# Altium project MCU103A.PrjPcb (part 3 of 4)

## Sheet MCU103A_USB_and_Power.SchDoc
size 431 x 279 mm; Date: Not shown in title block; ApprovedBy: Not shown in title block; CheckedBy: Not shown in title block; Author: Not shown in title block; CompanyName: Not shown in title block; Engineer: Not shown in title block; Organization: Not shown in title block; Address1: Not shown in title block; Address2: Not shown in title block; Address3: Not shown in title block; Address4: Not shown in title block; DocumentNumber: 6; Revision: Use project parameter SCH_Rev; SheetNumber: 6; SheetTotal: 8; PageSetup: Record=PageOptions|CenterHorizontal=True|CenterVertical=True|PrintScale=1.00|XCorrection=1.00|YCorrection=1.00|PrintKind=0|BorderSize=5000000|LeftOffset=0|BottomOffset=0|Orientation=2|PaperLength=1000|PaperWidth=1000|Scale=100|PaperSource=15|PrintQuality=600|MediaType=1|DitherType=10|PaperKind=Letter|PrintScaleMode=1; CurrentTime: Not shown in title block; CurrentDate: Not shown in title block; Time: Not shown in title block; DocumentFullPathAndName: Not shown in title block; DocumentName: Not shown in title block; ModifiedDate: Not shown in title block; ImagePath: Not shown in title block
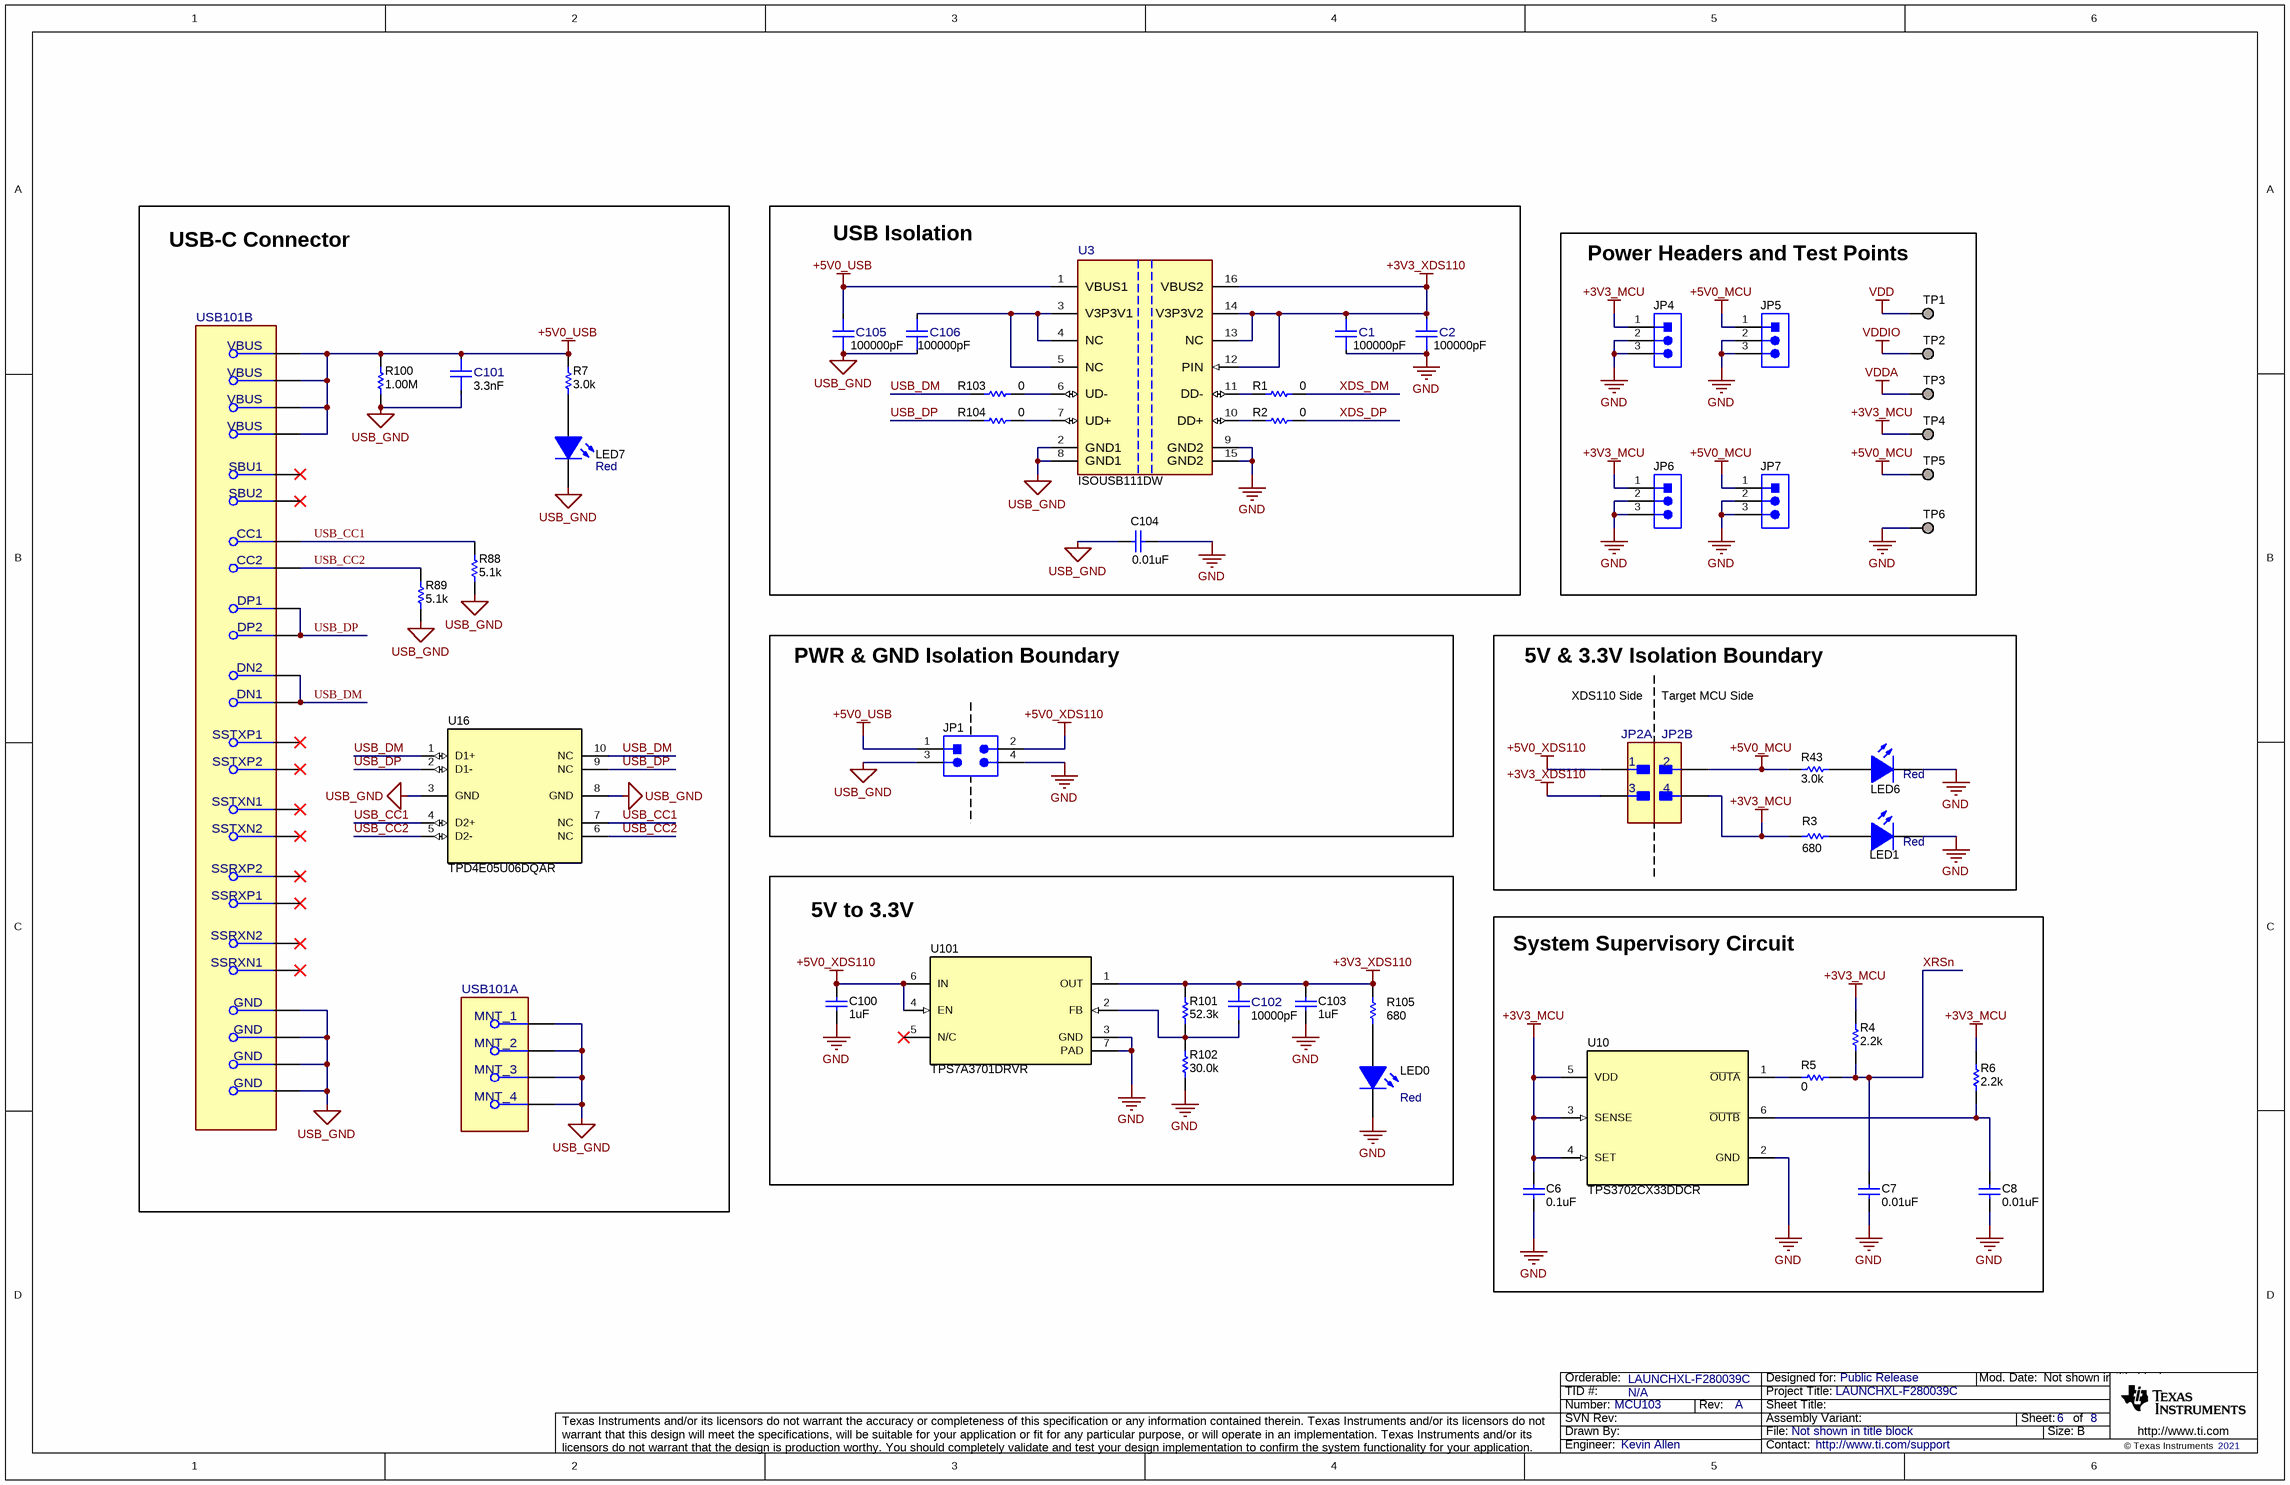
[diagram p5: MCU103A_USB_and_Power.SchDoc]

### Parts
C1  ValueDisplayed: 100000pF  [FP-885012205018_0402-MFG]  (hidden comment: 885012205018)
C2  ValueDisplayed: 100000pF  [FP-885012205018_0402-MFG]  (hidden comment: 885012205018)
C6  ValueDisplayed: 0.1uF  [0402]  (hidden comment: GRM155R71A104KA01D)
C7  ValueDisplayed: 0.01uF  [0402]  (hidden comment: GRM155R71E103KA01D)
C8  ValueDisplayed: 0.01uF  [0402]  (hidden comment: GRM155R71E103KA01D)
C100  ValueDisplayed: 1uF  [0402]  (hidden comment: 885012105012)
C101  ValueDisplayed: 3.3nF  [FP-885012205064_0402-MFG]  (hidden comment: 885012205064)
C102  ValueDisplayed: 10000pF  [FP-885012205050_0402-MFG]  (hidden comment: 885012205050)
C103  ValueDisplayed: 1uF  [0402]  (hidden comment: 885012105012)
C104  ValueDisplayed: 0.01uF  [1812]  (hidden comment: 1812SC103KAT1A)
C105  ValueDisplayed: 100000pF  [FP-885012205018_0402-MFG]  (hidden comment: 885012205018)
C106  ValueDisplayed: 100000pF  [FP-885012205018_0402-MFG]  (hidden comment: 885012205018)
JP1  TSM-102-01-L-DV  [Samtec_TSM-102-01-x-DV]  (value not drawn)
JP2  61300421121  [FP-61300421121_HDR4-MFG]  (value not drawn)  (parts A,B of 2)
JP4  61300311121  [WURTH_61300311121]  (value not drawn)
JP5  61300311121  [WURTH_61300311121]  (value not drawn)
JP6  61300311121  [WURTH_61300311121]  (value not drawn)
JP7  61300311121  [WURTH_61300311121]  (value not drawn)
LED0  value Red  [WL-SMCW_RED_0805]  (hidden comment: 150080SS75000)
LED1  value Red  [WL-SMCW_RED_0805]  (hidden comment: 150080SS75000)
LED6  value Red  [WL-SMCW_RED_0805]  (hidden comment: 150080SS75000)
LED7  value Red  [WL-SMCW_RED_0805]  (hidden comment: 150080SS75000)
R1  ValueDisplayed: 0  [0402]  (hidden comment: RC0402JR-070RL)
R2  ValueDisplayed: 0  [0402]  (hidden comment: RC0402JR-070RL)
R3  ValueDisplayed: 680  [0402]  (hidden comment: CRCW0402680RJNED)
R4  ValueDisplayed: 2.2k  [0402]  (hidden comment: CRCW04022K20JNED)
R5  ValueDisplayed: 0  [0402]  (hidden comment: CRCW04020000Z0ED)
R6  ValueDisplayed: 2.2k  [0603]  (hidden comment: CRCW06032K20JNEA)
R7  ValueDisplayed: 3.0k  [0603]  (hidden comment: RC0603JR-073KL)
R43  ValueDisplayed: 3.0k  [0603]  (hidden comment: RC0603JR-073KL)
R88  ValueDisplayed: 5.1k  [0603]  (hidden comment: RC0603JR-075K1L)
R89  ValueDisplayed: 5.1k  [0603]  (hidden comment: RC0603JR-075K1L)
R100  ValueDisplayed: 1.00M  [0402]  (hidden comment: CRCW04021M00FKED)
R101  ValueDisplayed: 52.3k  [0402]  (hidden comment: CRCW040252K3FKED)
R102  ValueDisplayed: 30.0k  [0402]  (hidden comment: CRCW040230K0FKED)
R103  ValueDisplayed: 0  [0402]  (hidden comment: RC0402JR-070RL)
R104  ValueDisplayed: 0  [0402]  (hidden comment: RC0402JR-070RL)
R105  ValueDisplayed: 680  [0402]  (hidden comment: CRCW0402680RJNED)
TP1  TESTPOINT  [TP_50MIL-25MILHOLE]  (value not drawn)  (no BOM)
TP2  TESTPOINT  [TP_50MIL-25MILHOLE]  (value not drawn)  (no BOM)
TP3  TESTPOINT  [TP_50MIL-25MILHOLE]  (value not drawn)  (no BOM)
TP4  TESTPOINT  [TP_50MIL-25MILHOLE]  (value not drawn)  (no BOM)
TP5  TESTPOINT  [TP_50MIL-25MILHOLE]  (value not drawn)  (no BOM)
TP6  TESTPOINT  [TP_50MIL-25MILHOLE]  (value not drawn)  (no BOM)
U3  ISOUSB111DW  [DW0016B-MFG]
U10  TPS3702CX33DDCR  [DDC0006A_N]
U16  TPD4E05U06DQAR  [DQA0010A]
U101  TPS7A3701DRVR  [DRV0006A]
USB101  MUP-U22001  [FP-MUP-U22001_CONN_USB_8MM94_8MM0-MFG]  (value not drawn)  (parts A,B of 2)

### Blocks framed on the sheet
USB-C Connector: C101 LED7 R7 R88 R89 R100 U16 USB101
USB Isolation: C1 C2 C104-C106 R1 R2 R103 R104 U3
Power Headers and Test Points: JP4-JP7 TP1-TP6
PWR & GND Isolation Boundary: JP1
5V & 3.3V Isolation Boundary: JP2 LED1 LED6 R3 R43
5V to 3.3V: C100 C102 C103 LED0 R101 R102 R105 U101
System Supervisory Circuit: C6-C8 R4-R6 U10

### Nets
+3V3_MCU: C6.2 JP2.4 JP4.1 JP6.1 R3.2 R4.2 R6.2 TP4.1 U10.3(SENSE) U10.4(SET) U10.5(VDD)
+3V3_XDS110: C1.2 C2.2 C102.2 C103.1 JP2.3 R101.2 R105.2 U3.12(PIN) U3.13(NC) U3.14(V3P3V2) U3.16(VBUS2) U101.1(OUT)
+5V0_MCU: JP2.2 JP5.1 JP7.1 R43.2 TP5.1
+5V0_USB: C101.2 C105.2 JP1.1 R7.2 R100.2 U3.1(VBUS1) USB101.A4(VBUS) USB101.A9(VBUS) USB101.B4(VBUS) USB101.B9(VBUS)
+5V0_XDS110: C100.1 JP1.2 JP2.1 U101.4(EN) U101.6(IN)
GND: C1.1 C2.1 C6.1 C7.2 C8.2 C100.2 C103.2 C104.1 JP1.4 JP4.2 JP4.3 JP5.2 JP5.3 JP6.2 JP6.3 JP7.2 JP7.3 LED0.1(K) LED1.1(K) LED6.1(K) R102.1 TP6.1 U3.9(GND2) U3.15(GND2) U10.2(GND) U101.3(GND) U101.7(PAD)
USB_GND: C101.1 C104.2 C105.1 C106.1 JP1.3 LED7.1(K) R88.1 R89.1 R100.1 U3.2(GND1) U3.8(GND1) U16.3(GND) U16.8(GND) USB101.1(MNT_1) USB101.2(MNT_2) USB101.3(MNT_3) USB101.4(MNT_4) USB101.A1(GND) USB101.A12(GND) USB101.B1(GND) USB101.B12(GND)
VDD: TP1.1
VDDA: TP3.1
VDDIO: TP2.1
USB_CC1: R88.2 U16.4(D2+) U16.7(NC) USB101.A5(CC1)
USB_CC2: R89.2 U16.5(D2-) U16.6(NC) USB101.B5(CC2)
USB_DM: R103.1 U16.1(D1+) U16.10(NC) USB101.A7(DN1) USB101.B7(DN2)
USB_DP: R104.1 U16.2(D1-) U16.9(NC) USB101.A6(DP1) USB101.B6(DP2)
XDS_DM: R1.2
XDS_DP: R2.2
XRSn: C7.1 R4.1 R5.2
NetC8_1: C8.1 R6.1 U10.6(~{OUTB})
NetC102_1: C102.1 R101.1 R102.2 U101.2(FB)
NetC106_2: C106.2 U3.3(V3P3V1) U3.4(NC) U3.5(NC)
NetLED0_2: LED0.2(A) R105.1
NetLED1_2: LED1.2(A) R3.1
NetLED6_2: LED6.2(A) R43.1
NetLED7_2: LED7.2(A) R7.1
NetR1_1: R1.1 U3.11(DD-)
NetR2_1: R2.1 U3.10(DD+)
NetR5_1: R5.1 U10.1(~{OUTA})
NetR103_2: R103.2 U3.6(UD-)
NetR104_2: R104.2 U3.7(UD+)

Not connected (* = marked no-connect by the designer): U101 5(N/C)*; USB101 A2(SSTXP1)* A3(SSTXN1)* A8(SBU1)* A10(SSRXN2)* A11(SSRXP2)* B2(SSTXP2)* B3(SSTXN2)* B8(SBU2)* B10(SSRXN1)* B11(SSRXP1)*

### Notes on the sheet
- XDS110 Side
- Target MCU Side
- Drawn By:
- SVN Rev:
- Number:
- TID #:
- Orderable:
- Rev:
- Sheet Title:
- File:
- Project Title:
- Designed for:
- Assembly Variant:
- Mod. Date:
- Sheet:
- Size:
- of
- B
- http://www.ti.com
- Texas Instruments and/or its licensors do not warrant the accuracy or completeness of this specification or any information contained therein. Texas Instruments and/or its licensors do not warrant that this design will meet the specifications, will be suitable for your application or fit for any particular purpose, or will operate in an implementation. Texas Instruments and/or its licensors do not warrant that the design is production worthy. You should completely validate and test your design implementation to confirm the system functionality for your application.
- Engineer:
- Contact:
- © Texas Instruments

### Library data of the parts
C1 C2 C105 C106 = CMP-0090362-1: 0.1µF ±10% 10V Ceramic Capacitor X7R 0402 (1005 Metric); Manufacturer: Wurth Electronics; AEC Qualified: No; Value: 100nF; SizeZ_mm: 0.55mm; TempCo: 15%; RoHS: TRUE; Tolerance_%: 10%; datasheet: https://www.we-online.com/catalog/datasheet/885012205018.pdf; Lead Free: Yes; Operating Temperature Range: -55°C to +125°C; ComponentLink1Description: Datasheet; Digikey Description: CAP CER 0.1UF 10V X7R 0402; Supplier Part Number 1: 732-7513-1-ND; Supplier 2: Mouser; Mouser Part Number: 710-885012205018; Digikey Part Number: 732-7513-1-ND; Temperature Characteristic: X7R; Supplier 1: Digikey; Datasheet Path: datasheets/Cap-885012205018.pdf; ComponentLink1URL: https://www.we-online.com/catalog/datasheet/885012205018.pdf; VDC_V: 10V; Supplier Part Number 2: 710-885012205018; Cap_F: 100nF; PackageReference: 0402; PartNumber: 885012205018; Part Number: 885012205018; helpURL: https://upverter.com/upn/revision/1acbe355db19639d/
C6 = CMP-0006629-2: CAP, CERM, 0.1 uF, 10 V, +/- 10%, X7R, 0402; Manufacturer: MuRata; Polarized: N; Value: 0.1uF; U/M: EA; Cap_F: 100nF; Value1: Unknown; VDC_V: 10V; TaMin_C: -55°C; TaMax_C: 125°C; SizeArea_mm2: 0.5; SizeAreaWB_mm2: 3; SizeX_mm: 1; SizeZ_mm: 0.6; AEC Category: Q200; CompType: Capacitor; PartNumber: GRM155R71A104KA01D; PackageReference: 0402; RoHS: Y; Tolerance_%: 10%; Value2: 10V; MountType: SMT; Technology: Ceramic; TempCo: X7R; Cap_Case: 0402; SizeY_mm: 0.5; Published: 2008-06-19; Publisher: Texas Instruments; LatestRevisionDate: 2017-03-09; ComponentLink1Description: Datasheet link; ComponentLink1URL: http://search.murata.co.jp/Ceramy/PnsearchViewAction.do?HnOFG=ON&HnNFG=ON&SEL_CNT=50&sLang=en&sKey=GRM155R71A104KA01D&x=9&y=9&search=startwith; Supplier 1: Digi-Key; Supplier Part Number 1: GRM155R71A104KA01D-ND; Supplier 2: Newark; Supplier Part Number 2: 14T3278; Supplier 3: Mouser; Supplier Part Number 3: 81-GRM155R71A104KA1D; AEC Qualified: ?
C7 C8 = CMP-0006658-2: CAP, CERM, 0.01 uF, 25 V, +/- 10%, X7R, 0402; Manufacturer: MuRata; Polarized: N; Value: 0.01uF; U/M: EA; Cap_F: 10nF; Value1: Unknown; VDC_V: 25V; TaMin_C: -55°C; TaMax_C: 125°C; SizeArea_mm2: 0.5; SizeAreaWB_mm2: 3; SizeX_mm: 1; SizeZ_mm: 0.6; AEC Category: Q200; CompType: Capacitor; PartNumber: GRM155R71E103KA01D; PackageReference: 0402; RoHS: Y; Tolerance_%: 10%; Value2: 25V; MountType: SMT; Technology: Ceramic; TempCo: X7R; Cap_Case: 0402; SizeY_mm: 0.5; Published: 2008-06-19; Publisher: Texas Instruments; LatestRevisionDate: 2017-03-09; ComponentLink1Description: Datasheet link; ComponentLink1URL: http://search.murata.co.jp/Ceramy/PnsearchViewAction.do?HnOFG=ON&HnNFG=ON&SEL_CNT=50&sLang=en&sKey=GRM155R71E103KA01D&x=9&y=9&search=startwith; Supplier 1: Digi-Key; Supplier Part Number 1: 490-1312-1-ND; Supplier 2: Mouser; Supplier Part Number 2: 81-GRM36X103K25; Supplier 3: Farnell; Supplier Part Number 3: 8819734; AEC Qualified: ?
C100 C103 = CMP-0064924-2: CAP, CERM, 1 uF, 10 V,+/- 20%, X5R, 0402; Manufacturer: Wurth Elektronik; Polarized: N; Value: 1uF; U/M: EA; Cap_F: 1µF; Value1: Unknown; VDC_V: 10V; TaMin_C: -55°C; TaMax_C: 85°C; SizeArea_mm2: 0.5; SizeAreaWB_mm2: 3; SizeX_mm: 1; SizeZ_mm: 0.6; AEC Category: Q200; CompType: Capacitor; PartNumber: 885012105012; PackageReference: 0402; RoHS: Y; Tolerance_%: 20%; Value2: 10V; MountType: SMT; Technology: Ceramic; TempCo: X5R; Cap_Case: 0402; SizeY_mm: 0.5; Published: 2008-06-19; Publisher: Texas Instruments; LatestRevisionDate: 2017-06-05; ComponentLink1Description: Datasheet link; ComponentLink1URL: http://katalog.we-online.de/pbs/datasheet/885012105012.pdf; Supplier 1: Digi-Key; Supplier Part Number 1: 732-7489-1-ND; Supplier 2: Newark; Supplier Part Number 2: 75Y5997; Supplier 3: Mouser; Supplier Part Number 3: 710-885012105012; AEC Qualified: N; AEC Grade: N/A
C101 = CMP-0092424-1: Cap Cer 3300pF 50V X7R 0402; Manufacturer: Wurth Electronics; TempCo: 15%; AEC Qualified: No; Value: 3.3nF; SizeZ_mm: 0.55mm; Tolerance_%: 10%; Part Number: 885012205064; Supplier 2: Mouser; RoHS: TRUE; Lead Free: Yes; ComponentLink1Description: Datasheet; Cap_F: 3.3nF; Supplier 1: Digikey; Digikey Description: CAP CER 3300PF 50V X7R 0402; Digikey Part Number: 732-7559-1-ND; Temperature Characteristic: X7R; Operating Temperature Range: -55°C to +125°C; Supplier Part Number 2: 710-885012205064; Datasheet Path: datasheets/Cap-885012205064.pdf; datasheet: https://www.we-online.com/catalog/datasheet/885012205064.pdf; helpURL: https://upverter.com/upn/revision/78c7421d1fb19545/; Supplier Part Number 1: 732-7559-1-ND; Mouser Part Number: 710-885012205064; PackageReference: 0402; PartNumber: 885012205064; ComponentLink1URL: https://www.we-online.com/catalog/datasheet/885012205064.pdf; VDC_V: 50V
C102 = CMP-0090363-1: 10000pF ±10% 25V Ceramic Capacitor X7R 0402 (1005 Metric); Manufacturer: Wurth Electronics; SizeZ_mm: 0.55mm; Cap_F: 10nF; AEC Qualified: No; Value: 10nF; TempCo: 15%; Digikey Description: CAP CER 10000PF 25V X7R 0402; RoHS: TRUE; PackageReference: 0402; Lead Free: Yes; datasheet: https://www.we-online.com/catalog/datasheet/885012205050.pdf; Datasheet Path: datasheets/Cap-885012205050.pdf; Mouser Part Number: 710-885012205050; Operating Temperature Range: -55°C to +125°C; Supplier 1: Digikey; Part Number: 885012205050; ComponentLink1URL: https://www.we-online.com/catalog/datasheet/885012205050.pdf; Tolerance_%: 10%; Digikey Part Number: 732-7545-1-ND; Temperature Characteristic: X7R; Supplier Part Number 1: 732-7545-1-ND; helpURL: https://upverter.com/upn/revision/f9df62cb48b9b255/; PartNumber: 885012205050; Supplier 2: Mouser; ComponentLink1Description: Datasheet; Supplier Part Number 2: 710-885012205050; VDC_V: 25V
C104 = CMP-0009297-2: CAP, CERM, 0.01 uF, 1500 V, +/- 10%, X7R, 1812; Manufacturer: AVX; TaMin_C: -55°C; ESR_ohm: 0.05; Polarized: N; SizeAreaWB_mm2: 23.1; Value1: 0.05 ohm; U/M: EA; Value: 0.01uF; TaMax_C: 125°C; SizeZ_mm: 1.35; SizeX_mm: 4.5; SizeY_mm: 3.2; Value2: 1500V; SizeArea_mm2: 14.4; Cap_F: 10nF; VDC_V: 1.5kV; AEC Category: Q200; Supplier Part Number 2: 96M1562; Publisher: Texas Instruments; Supplier 2: Newark; Supplier Part Number 3: 581-1812SC103KAT1A; TempCo: X7R; Supplier 3: Mouser; Published: 2008-06-19; RoHS: Y; MountType: SMT; Supplier 1: Digi-Key; PackageReference: 1812; Tolerance_%: 10%; Cap_Case: 1812; CompType: Capacitor; LatestRevisionDate: 2017-03-09; PartNumber: 1812SC103KAT1A; AEC Qualified: N; ComponentLink1Description: Datasheet link; AEC Grade: N/A; Supplier Part Number 1: 478-4735-1-ND; Technology: Ceramic; ComponentLink1URL: http://datasheets.avx.com/AVX-HV_MLCC.pdf
JP1 = CMP-0055559-1: Header, 2.54mm, 2x2, Gold, SMT; Manufacturer: Samtec; CNHeader: TRUE; Shrouded: N; Gender: Male; Cert_CSA: Y; Voltage_V: 475V; Row_Count: 2; Pitch_mm: 2.54; CT: FALSE; ComponentLink1URL: http://suddendocs.samtec.com/catalog_english/tsm.pdf; ClassName: Header; Supplier Part Number 2: 27C2242; Publisher: Texas Instruments; Supplier 2: Newark; Supplier Part Number 3: 1803290; Color: Black; Supplier 3: Farnell; RoHS: Y; MountType: SMT; Supplier 1: Digi-Key; PackageReference: Header, 2.54mm, 2x2, SMT; PinCount: 4; CompType: Header; LatestRevisionDate: 26/05/2017; PartNumber: TSM-102-01-L-DV; Orientation: Vertical; ComponentLink1Description: Datasheet URL; Supplier Part Number 1: TSM-102-01-L-DV-ND; ContactFinish: Gold; Cert_UL: Y
JP2 = CMP-0092422-1: THT Vertical Pin Header WR-PHD, Pitch 2.54 mm, Dual Row, 4 pins; Manufacturer: Wurth Electronics; DUT-Pitch_mm: 2.54mm; SizeZ_mm: 8.89mm; Voltage_V: 250V; Conn Gender: Male; AEC Qualified: No; Row_Count: 2; ContactFinish: Gold; Conn Orientation: Straight; Current_A: 3A; Supplier Part Number 2: 710-61300421121; Supplier 1: Digikey; Mouser Part Number: 710-61300421121; Operating Temperature Range: -40°C to +105°C; ComponentLink1URL: https://www.we-online.com/catalog/datasheet/61300421121.pdf; Lead Free: Yes; PinCount: 4; Supplier Part Number 1: 732-5294-ND; Part Number: 61300421121; RoHS: TRUE; Digikey Part Number: 732-5294-ND; Is Female: no; Digikey Description: CONN HEADER VERT 4POS 2.54MM; datasheet: https://www.we-online.com/catalog/datasheet/61300421121.pdf; PartNumber: 61300421121; Supplier 2: Mouser; Datasheet Path: datasheets/Conn-61300421121.pdf; PackageReference: HDR4; helpURL: https://upverter.com/upn/revision/de171c811246619e/; ComponentLink1Description: Datasheet
JP4-JP7 = CMP-0054796-1: Header, 2.54 mm, 3x1, Gold, TH; Manufacturer: Wurth Elektronik; Green_Lifecycle: Active; Green_REACh: Passed; CNHeader: TRUE; CT: FALSE; PartNumber: 61300311121; PackageReference: Header, 2.54mm, 3x1, TH; ClassName: Header; CompType: Header; RoHS: Y; MountType: TH; ComponentLink1Description: Datasheet URL; ComponentLink1URL: http://katalog.we-online.de/em/datasheet/6130xx11121.pdf; Publisher: Texas Instruments; LatestRevisionDate: 26/05/2017; Supplier 1: Digi-Key; Supplier Part Number 1: 732-5316-ND; Supplier 2: Newark; Supplier Part Number 2: 20X0950; Supplier 3: Farnell; Supplier Part Number 3: 356154; Green_EU RoHS: Passed; Green_EU RoHS-2: Incomplete
LED0 LED1 LED6 LED7 = CMP-0002951-3: LED, Red, SMD; Manufacturer: Wurth Elektronik; Type: AlInGaP; Vf_V: 1.9V; Io_A: 30mA; Vr_V: 5V; Ir_A: 25µA; Tjmax_C: 85°C; Power_TotalModule: 72mW; Value1: 0.072W; Angle: 140; CompType: LED; PartNumber: 150080SS75000; MountType: SMT; RoHS: Y; PackageReference: LED_0805; Value2: 1.9V; Color: Red; ComponentLink1URL: http://katalog.we-online.de/led/datasheet/150080SS75000.pdf; ComponentLink1Description: Datasheet link
R1 R2 R103 R104 = CMP-0027004-2: RES, 0, 5%, 0.063 W, 0402; Manufacturer: Yageo America; Power_W: 63mW; TempCo: 200 ppm/C; Value_Code: 0000; U/M: EA; Value: 0; EIA_Code: E24; SizeX_mm: 1; SizeY_mm: 0.5; SizeZ_mm: 0.6; Value2: 0.063W; VDC_V: 50V; AEC Category: Q200; Supplier Part Number 2: 603-RC0402JR-070RL; Publisher: Texas Instruments; Supplier 2: Mouser; Supplier Part Number 3: 9232516; Supplier 3: Farnell; Published: 2008-06-26; RoHS: Y; Value1: 5%; MountType: SMT; Supplier 1: Digi-Key; PackageReference: 0402; Tolerance_%: 5%; Res_ohm: 0; SizeArea_mm2: 0.5; CompType: Resistor; LatestRevisionDate: 2017-03-09; PartNumber: RC0402JR-070RL; AEC Qualified: ?; ComponentLink1Description: Datasheet link; Supplier Part Number 1: 311-0.0JRCT-ND; Technology: Thick Film; ComponentLink1URL: http://www.yageo.com/pdf/Pu-RC0402_51_PbFree_L_2.pdf
R3 R105 = CMP-0026962-3: RES, 680, 5%, 0.063 W, AEC-Q200 Grade 0, 0402; Manufacturer: Vishay-Dale; Power_W: 63mW; TempCo: 200 ppm/C; Value_Code: 680R; Value: 680; EIA_Code: E24; SizeX_mm: 1; SizeY_mm: 0.5; SizeZ_mm: 0.6; Value2: 0.063W; AEC Qualified: Y; VDC_V: 50V; AEC Category: Q200; AEC Grade: 0; Supplier Part Number 2: 59M6744; Supplier 2: Newark; Supplier Part Number 3: 71-CRCW0402J-680-E3; Supplier 3: Mouser; RoHS: E; Value1: 5%; MountType: SMT; Supplier 1: Digi-Key; PackageReference: 0402; Tolerance_%: 5%; Res_ohm: 680; SizeArea_mm2: 0.5; CompType: Resistor; PartNumber: CRCW0402680RJNED; ComponentLink1Description: Datasheet link; Supplier Part Number 1: 541-680JCT-ND; Technology: Thick Film; ComponentLink1URL: http://www.vishay.com/docs/20035/dcrcwe3.pdf
R4 = CMP-0026890-5: RES, 2.2 k, 5%, 0.063 W, AEC-Q200 Grade 0, 0402; Manufacturer: Vishay-Dale; Value: 2.2k; Value_Code: 2k20; Power_W: 63mW; Value2: 0.063W; VDC_V: 50V; TempCo: 200 ppm/C; SizeArea_mm2: 0.5; SizeX_mm: 1; SizeZ_mm: 0.6; EIA_Code: E24; AEC Category: Q200; AEC Qualified: Y; AEC Grade: 0; CompType: Resistor; PartNumber: CRCW04022K20JNED; PackageReference: 0402; RoHS: E; Res_ohm: 2.2k; Tolerance_%: 5%; Value1: 5%; MountType: SMT; Technology: Thick Film; SizeY_mm: 0.5; ComponentLink1Description: Datasheet link; ComponentLink1URL: http://www.vishay.com/docs/20035/dcrcwe3.pdf; Supplier 1: Digi-Key; Supplier Part Number 1: 541-2.2KJCT-ND; Supplier 2: Newark; Supplier Part Number 2: 59M6710; Supplier 3: Mouser; Supplier Part Number 3: 71-CRCW0402J-2.2K-E3
R5 = CMP-0026822-3: RES, 0, 5%, 0.063 W, AEC-Q200 Grade 0, 0402; Manufacturer: Vishay-Dale; Value: 0; Value_Code: 0000; Power_W: 63mW; Value2: 0.063W; VDC_V: 50V; TempCo: 200 ppm/C; SizeArea_mm2: 0.5; SizeX_mm: 1; SizeZ_mm: 0.6; EIA_Code: E24; AEC Category: Q200; AEC Qualified: Y; CompType: Resistor; PartNumber: CRCW04020000Z0ED; PackageReference: 0402; RoHS: E; Res_ohm: 0; Tolerance_%: 5%; Value1: 5%; MountType: SMT; Technology: Thick Film; SizeY_mm: 0.5; ComponentLink1Description: Datasheet link; ComponentLink1URL: http://www.vishay.com/docs/20035/dcrcwe3.pdf; Supplier 1: Digi-Key; Supplier Part Number 1: 541-0.0JCT-ND; Supplier 2: Newark; Supplier Part Number 2: 52K6543; Supplier 3: Mouser; Supplier Part Number 3: 71-CRCW0402-0-E3; AEC Grade: 0
R6 = CMP-0025769-4: RES, 2.2 k, 5%, 0.1 W, AEC-Q200 Grade 0, 0603; Manufacturer: Vishay-Dale; Value: 2.2k; Value_Code: 2k20; Power_W: 100mW; Value2: 0.1W; VDC_V: 75V; TempCo: 200 ppm/C; SizeArea_mm2: 1.28; SizeX_mm: 1.6; SizeY_mm: 0.8; SizeZ_mm: 1; EIA_Code: E24; AEC Category: Q200; AEC Qualified: Y; AEC Grade: 0; CompType: Resistor; PartNumber: CRCW06032K20JNEA; PackageReference: 0603; RoHS: E; Res_ohm: 2.2k; Tolerance_%: 5%; Value1: 5%; MountType: SMT; Technology: Thick Film; ComponentLink1Description: Datasheet link; ComponentLink1URL: http://www.vishay.com/docs/20035/dcrcwe3.pdf; Supplier 1: Digi-Key; Supplier Part Number 1: 541-2.2KGCT-ND; Supplier 2: Newark; Supplier Part Number 2: 59M6776; Supplier 3: Farnell; Supplier Part Number 3: 1652868
R7 R43 = CMP-0025921-5: RES, 3.0 k, 5%, 0.1 W, 0603; Manufacturer: Yageo; Power_W: 100mW; TempCo: 100 ppm/C; Value_Code: 3k00; Value: 3.0k; EIA_Code: E24; Res_ohm: 3k; SizeX_mm: 1.6; SizeY_mm: 0.8; SizeZ_mm: 1; Value2: 0.1W; SizeArea_mm2: 1.28; AEC Qualified: N; VDC_V: 75V; AEC Category: Q200; SizeAreaWB_mm2: 4.68; Supplier Part Number 2: 603-RC0603JR-073KL; Supplier 2: Mouser; Supplier Part Number 3: 1799415; Supplier 3: Farnell; RoHS: Y; Value1: 5%; MountType: SMT; Supplier 1: Digi-Key; PackageReference: 0603; Tolerance_%: 5%; CompType: Resistor; PartNumber: RC0603JR-073KL; ComponentLink1Description: Datasheet link; Supplier Part Number 1: 311-3.0KGRCT-ND; Technology: Thick Film; ComponentLink1URL: http://www.yageo.com/pdf/Pu-RC0603_51_PbFree_L_2.pdf; AEC Grade: N/A
R88 R89 = CMP-0025932-5: RES, 5.1 k, 5%, 0.1 W, 0603; Manufacturer: Yageo; Power_W: 100mW; TempCo: 100 ppm/C; Value_Code: 5k10; Value: 5.1k; EIA_Code: E24; SizeX_mm: 1.6; SizeY_mm: 0.8; SizeZ_mm: 1; Value2: 0.1W; SizeArea_mm2: 1.28; AEC Qualified: N; VDC_V: 75V; AEC Category: Q200; SizeAreaWB_mm2: 4.68; Supplier Part Number 2: 603-RC0603JR-075K1L; Supplier 2: Mouser; Supplier Part Number 3: 1799436; Supplier 3: Farnell; RoHS: Y; Value1: 5%; MountType: SMT; Supplier 1: Digi-Key; PackageReference: 0603; Tolerance_%: 5%; Res_ohm: 5.1k; CompType: Resistor; PartNumber: RC0603JR-075K1L; ComponentLink1Description: Datasheet link; Supplier Part Number 1: 311-5.1KGRCT-ND; Technology: Thick Film; ComponentLink1URL: http://www.yageo.com/pdf/Pu-RC0603_51_PbFree_L_2.pdf; AEC Grade: N/A
R100 = CMP-0026100-2: RES, 1.00 M, 1%, 0.063 W, AEC-Q200 Grade 0, 0402; Manufacturer: Vishay-Dale; Value: 1.00Meg; Res_ohm: 1M; Value_Code: 1M00; Power_W: 63mW; Value2: 0.063W; VDC_V: 50V; TempCo: 100 ppm/C; SizeArea_mm2: 0.5; SizeX_mm: 1; SizeZ_mm: 0.6; EIA_Code: E96; AEC Category: Q200; AEC Qualified: Y; AEC Grade: 0; CompType: Resistor; PartNumber: CRCW04021M00FKED; PackageReference: 0402; RoHS: E; Tolerance_%: 1%; Value1: 1%; MountType: SMT; Technology: Thick Film; SizeY_mm: 0.5; ComponentLink1Description: Datasheet link; ComponentLink1URL: http://www.vishay.com/docs/20035/dcrcwe3.pdf; Supplier 1: Digi-Key; Supplier Part Number 1: 541-1.00MLCT-ND; Supplier 2: Newark; Supplier Part Number 2: 52K6593; Supplier 3: Mouser; Supplier Part Number 3: 71-CRCW0402-1.0M-E3
R101 = CMP-0026441-2: RES, 52.3 k, 1%, 0.063 W, AEC-Q200 Grade 0, 0402; Manufacturer: Vishay-Dale; Power_W: 63mW; TempCo: 100 ppm/C; Value_Code: 52k3; Value: 52.3k; EIA_Code: E96; SizeX_mm: 1; SizeY_mm: 0.5; SizeZ_mm: 0.6; Value2: 0.063W; AEC Qualified: Y; VDC_V: 50V; AEC Category: Q200; AEC Grade: 0; ComponentLink1URL: http://www.vishay.com/docs/20035/dcrcwe3.pdf; Supplier Part Number 2: 52K7137; Supplier 2: Newark; Supplier Part Number 3: 71-CRCW0402-52.3K-E3; Supplier 3: Mouser; RoHS: E; Value1: 1%; MountType: SMT; Supplier 1: Digi-Key; PackageReference: 0402; Tolerance_%: 1%; Res_ohm: 52.3k; SizeArea_mm2: 0.5; CompType: Resistor; PartNumber: CRCW040252K3FKED; ComponentLink1Description: Datasheet link; Supplier Part Number 1: 541-52.3KLCT-ND; Technology: Thick Film
R102 = CMP-0078244-2: RES, 30.0 k, 1%, 0.063 W, AEC-Q200 Grade 0, 0402; Manufacturer: Vishay-Dale; Power_W: 63mW; Green_Lifecycle: Active; TempCo: 100 ppm/C; Value_Code: 30k0; Green_REACh: Passed; Value: 30.0k; Res_ohm: 30k; SizeX_mm: 1; SizeY_mm: 0.5; SizeZ_mm: 0.6; Value2: 0.063W; AEC Qualified: Y; VDC_V: 50V; AEC Grade: 0; AEC Category: Q200; ComponentLink1URL: http://www.vishay.com/docs/20035/dcrcwe3.pdf; Supplier Part Number 2: 52K6953; Supplier 2: Newark; Supplier Part Number 3: 71-CRCW0402-30K-E3; Supplier 3: Mouser; RoHS: E; Value1: 1%; MountType: SMT; Green_EU RoHS-2: Passed; Supplier 1: Digi-Key; Green_EU RoHS: Passed with Exemption; PackageReference: 0402; Tolerance_%: 1%; SizeArea_mm2: 0.5; CompType: Resistor; PartNumber: CRCW040230K0FKED; ComponentLink1Description: Datasheet link; Supplier Part Number 1: 541-30.0KLCT-ND; Technology: Thick Film
TP1-TP6 = CMP-0078143-3: TEST POINT.  No entry in BOM.; CompType: Testpoint; PackageReference: N/A; Manufacturer: N/A; PartNumber: N/A; Library Reference: TESTPOINT
U3 = CMP-0091303-1: Full/Low Speed Isolated USB Repeater, SOIC16-Wide; Manufacturer: Texas Instruments; Number Of Ports: 1; Usb Standard: USB 2.0; Min Supply Voltage: 3V; Data Rate: 12Mbits/s; Max Supply Voltage: 5.5V; TaMin_C: -40°C; SizeZ_mm: 2.65mm; TaMax_C: +125°C; Nominal Supply Current: 9-9.5mA; TJmax_C: +150°C; Standoff Height: 0.1mm; AEC Qualified: No; Part Number: ISOUSB111DW; Operating Temperature Range: -55°C to +150°C; PackageReference: SOICW16; Datasheet Path: datasheets/IC-ISOUSB111DW.pdf; Interface: USB; helpURL: https://upverter.com/upn/revision/bd93d5af0e7edffb/; RoHS: UNKNOWN; PartNumber: ISOUSB111DW
U10 = CMP-0067340-2: High-Accuracy, Fixed-Threshold OV/UV Monitor, DDC0006A (SOT-23-T-6); Alternate PartNumber: TPS3702CX33DDCT; Manufacturer: Texas Instruments; SizeArea_mm2: 4.8675; SizeAreaWB_mm2: 10.4675; SizeX_mm: 1.65; SizeY_mm: 2.95; SizeZ_mm: 0.87; CompType: IC; U/M: EA; PartNumber: TPS3702CX33DDCR; PackageReference: DDC0006A; PackageDescription: SOT-23-T-6; MountType: SMT; ComponentLink1Description: Datasheet Link; ComponentLink1URL: http://www.ti.com/lit/ds/symlink/tps3702.pdf; RoHS: Y; Publisher: Texas Instruments; LatestRevisionDate: 2017-06-09; Alternate Manufacturer: Texas Instruments
U16 = CMP-0073613-3: 4-Channel Ultra-Low-Capacitance IEC ESD Protection Diode, DQA0010A (USON-10); Alternate Manufacturer: Texas Instruments; Green_Lifecycle: Active; SizeAreaWB_mm2: 7.0; Green_REACh: Passed; SizeZ_mm: 0.55; SizeX_mm: 1.0; SizeY_mm: 2.5; CompType: IC; AEC Category: Q200; AEC Qualified: N; ComponentLink1URL: http://www.ti.com/lit/ds/symlink/tpd4e05u06.pdf; PackageDescription: USON-10; RoHS: Y; MountType: SMT; Green_EU RoHS-2: Passed; Manufacturer: Texas Instruments; Green_EU RoHS: Passed; PackageReference: DQA0010A; SizeArea_mm2: 2.5; PartNumber: TPD4E05U06DQAR; ComponentLink1Description: Datasheet Link; ComponentLink2Description: Product Folder; ComponentLink2URL: http://www.ti.com/product/tpd4e05u06; ComponentLink3Description: Online Datasheet; ComponentLink3URL: http://www.ti.com/product/tpd4e05u06/datasheet
U101 = CMP-0066914-5: 1% High-Accuracy, 1-A, Low-Dropout Regulator with Reverse Current Protection, DRV0006A (WSON-6); Manufacturer: Texas Instruments; Alternate PartNumber: TPS7A3701DRVT; SizeX_mm: 2; CompType: IC; SizeZ_mm: 0.8; SizeArea_mm2: 4; SizeAreaWB_mm2: 9; U/M: EA; PackageDescription: WSON-6; PartNumber: TPS7A3701DRVR; ComponentLink1URL: http://www.ti.com/lit/ds/symlink/tps7a3701.pdf; ComponentLink1Description: Datasheet Link; LatestRevisionDate: 2017-06-09; SizeY_mm: 2; Publisher: Texas Instruments; RoHS: Y; PackageReference: DRV0006A; MountType: SMT; Alternate Manufacturer: Texas Instruments
USB101 = CMP-0092137-1: Connector, USB Type-C 24 pin Mid Mount dual row Receptacle Surface Mount; Manufacturer: MUP; ContactFinish: Gold,Nickel; Usb Standard: OTHER; AEC Qualified: No; Conn Orientation: Horizontal; Shrouded: true; SizeZ_mm: 2.81mm; Is Female: yes; DUT-Pitch_mm: 0.5mm; Datasheet Path: datasheets/Conn-MUP-U22001.pdf; ComponentLink1URL: http://www.mupconnector.com/product/show/id/525.html; ComponentLink1Description: Datasheet; PartNumber: MUP-U22001; PackageReference: CONN_USB_8MM94_8MM0; helpURL: https://upverter.com/upn/revision/6b0c75e83cbd5706/; Part Number: MUP-U22001; RoHS: TRUE; datasheet: http://www.mupconnector.com/product/show/id/525.html; Lead Free: Yes; Operating Temperature Range: -25°C to +85°C; PinCount: 24

## Sheet MCU103A_XDS110_MCU.SchDoc
size 431 x 279 mm; Date: Not shown in title block; ApprovedBy: Not shown in title block; CheckedBy: Not shown in title block; Author: Not shown in title block; CompanyName: Not shown in title block; Engineer: Not shown in title block; Organization: Not shown in title block; Address1: Not shown in title block; Address2: Not shown in title block; Address3: Not shown in title block; Address4: Not shown in title block; DocumentNumber: 7; Revision: Use project parameter SCH_Rev; SheetNumber: 7; SheetTotal: 8; PageSetup: Record=PageOptions|CenterHorizontal=True|CenterVertical=True|PrintScale=1.00|XCorrection=1.00|YCorrection=1.00|PrintKind=0|BorderSize=5000000|LeftOffset=0|BottomOffset=0|Orientation=2|PaperLength=1000|PaperWidth=1000|Scale=100|PaperSource=15|PrintQuality=600|MediaType=1|DitherType=10|PaperKind=Letter|PrintScaleMode=1; CurrentTime: Not shown in title block; CurrentDate: Not shown in title block; Time: Not shown in title block; DocumentFullPathAndName: Not shown in title block; DocumentName: Not shown in title block; ModifiedDate: Not shown in title block; ImagePath: Not shown in title block
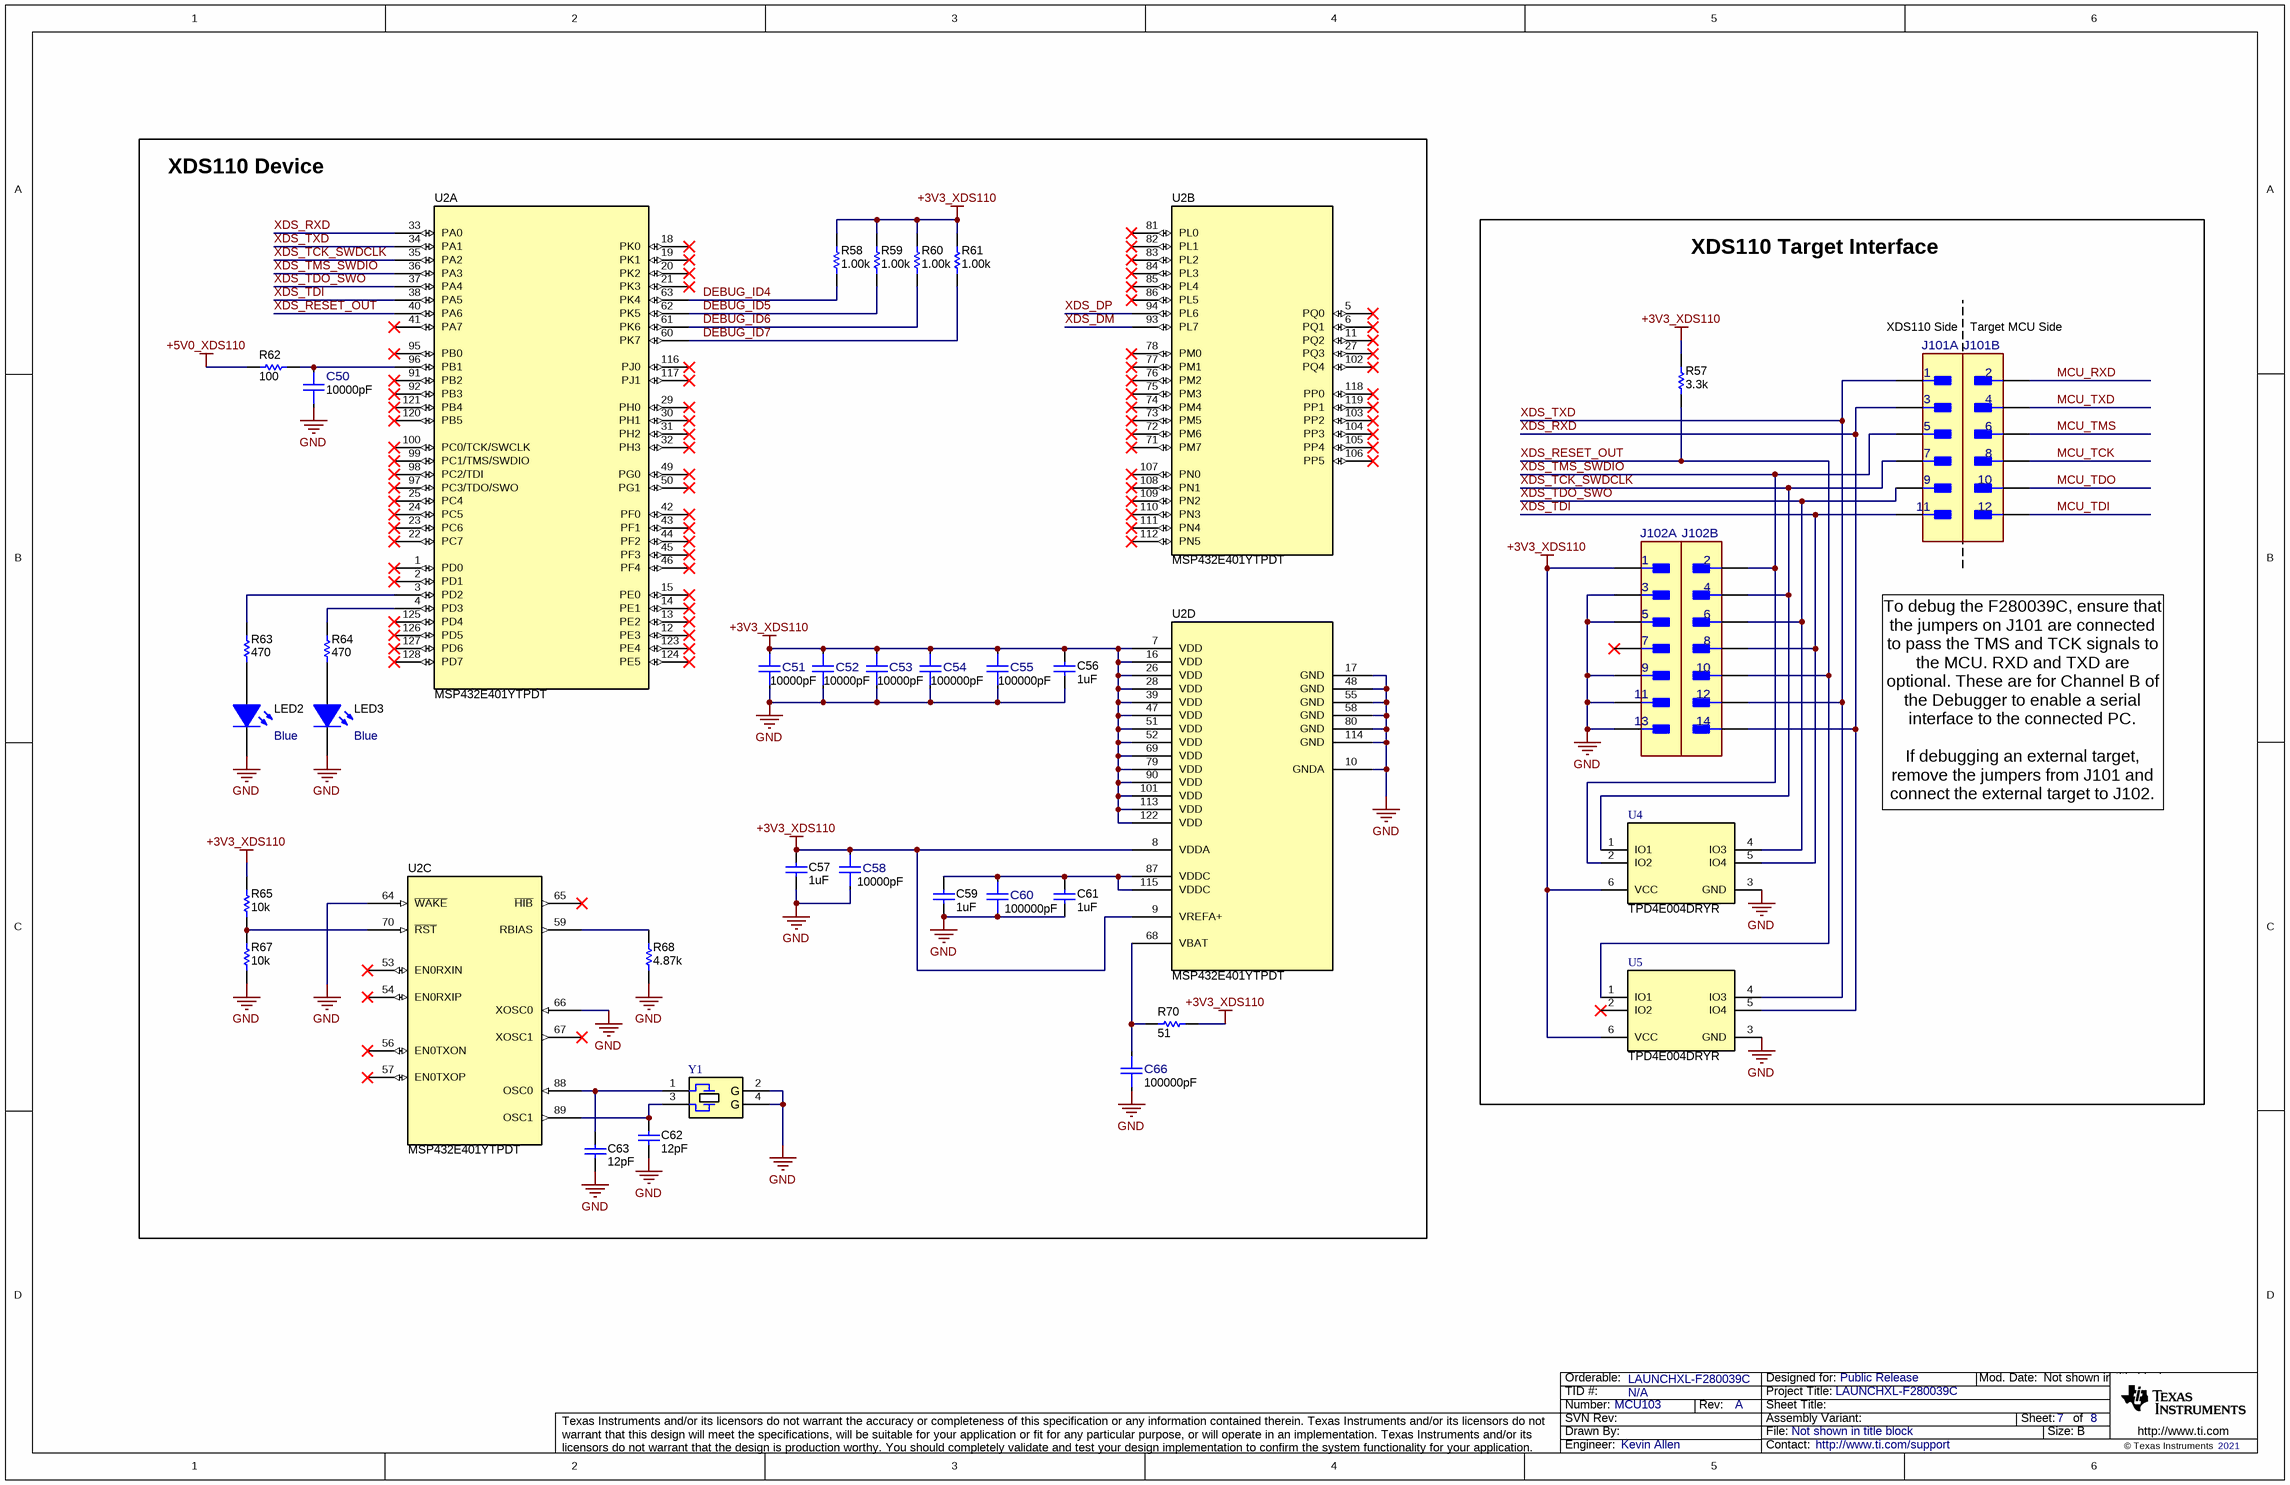
[diagram p6: MCU103A_XDS110_MCU.SchDoc]

### Parts
C50  ValueDisplayed: 10000pF  [FP-885012205050_0402-MFG]  (hidden comment: 885012205050)
C51  ValueDisplayed: 10000pF  [FP-885012205050_0402-MFG]  (hidden comment: 885012205050)
C52  ValueDisplayed: 10000pF  [FP-885012205050_0402-MFG]  (hidden comment: 885012205050)
C53  ValueDisplayed: 10000pF  [FP-885012205050_0402-MFG]  (hidden comment: 885012205050)
C54  ValueDisplayed: 100000pF  [FP-885012205018_0402-MFG]  (hidden comment: 885012205018)
C55  ValueDisplayed: 100000pF  [FP-885012205018_0402-MFG]  (hidden comment: 885012205018)
C56  ValueDisplayed: 1uF  [0402]  (hidden comment: 885012105012)
C57  ValueDisplayed: 1uF  [0402]  (hidden comment: 885012105012)
C58  ValueDisplayed: 10000pF  [FP-885012205050_0402-MFG]  (hidden comment: 885012205050)
C59  ValueDisplayed: 1uF  [0402]  (hidden comment: 885012105012)
C60  ValueDisplayed: 100000pF  [FP-885012205018_0402-MFG]  (hidden comment: 885012205018)
C61  ValueDisplayed: 1uF  [0402]  (hidden comment: 885012105012)
C62  ValueDisplayed: 12pF  [0402]  (hidden comment: GRM1555C1H120JA01D)
C63  ValueDisplayed: 12pF  [0402]  (hidden comment: GRM1555C1H120JA01D)
C66  ValueDisplayed: 100000pF  [FP-885012205018_0402-MFG]  (hidden comment: 885012205018)
J101  61301221121  [FP-61301221121_HDR12-MFG]  (value not drawn)  (parts A,B of 2)
J102  FTSH-107-01-F-DV-K  [FP-FTSH-107-01-F-DV-K_HDR14-MFG]  (value not drawn)  (parts A,B of 2)
LED2  value Blue  [LTST-C170TBKT_Blue]  (hidden comment: LTST-C170TBKT)
LED3  value Blue  [LTST-C170TBKT_Blue]  (hidden comment: LTST-C170TBKT)
R57  ValueDisplayed: 3.3k  [0402]  (hidden comment: CRCW04023K30JNED)
R58  ValueDisplayed: 1.00k  [0402]  (hidden comment: CRCW04021K00FKED)
R59  ValueDisplayed: 1.00k  [0402]  (hidden comment: CRCW04021K00FKED)
R60  ValueDisplayed: 1.00k  [0402]  (hidden comment: CRCW04021K00FKED)
R61  ValueDisplayed: 1.00k  [0402]  (hidden comment: CRCW04021K00FKED)
R62  ValueDisplayed: 100  [0402]  (hidden comment: CRCW0402100RJNED)
R63  ValueDisplayed: 470  [0402]  (hidden comment: RC0402FR-07470RL)
R64  ValueDisplayed: 470  [0402]  (hidden comment: RC0402FR-07470RL)
R65  ValueDisplayed: 10k  [0402]  (hidden comment: CRCW040210K0JNED)
R67  ValueDisplayed: 10k  [0402]  (hidden comment: CRCW040210K0JNED)
R68  ValueDisplayed: 4.87k  [0402]  (hidden comment: CRCW04024K87FKED)
R70  ValueDisplayed: 51  [0402]  (hidden comment: CRCW040251R0JNED)
U2  MSP432E401YTPDT  [PDT0128A]  (parts A,B,C,D of 4)
U4  TPD4E004DRYR  [DRY0006A]
U5  TPD4E004DRYR  [DRY0006A]
Y1  NX3225GA-16.000M-STD-CRG-1  [NDK_NX3225GA]  (value not drawn)

### Blocks framed on the sheet
XDS110 Device: C50-C63 C66 LED2 LED3 R58-R65 R67 R68 R70 U2 Y1
XDS110 Target Interface: J101 J102 R57 U4 U5

### Nets
+3V3_XDS110: C51.2 C52.2 C53.2 C54.2 C55.2 C56.1 C57.1 C58.2 J102.1 R57.2 R58.2 R59.2 R60.2 R61.2 R65.2 R70.2 U2.7(VDD) U2.8(VDDA) U2.9(VREFA+) U2.16(VDD) U2.26(VDD) U2.28(VDD) U2.39(VDD) U2.47(VDD) U2.51(VDD) U2.52(VDD) U2.69(VDD) U2.79(VDD) U2.90(VDD) U2.101(VDD) U2.113(VDD) U2.122(VDD) U4.6(VCC) U5.6(VCC)
+5V0_XDS110: R62.1
GND: C50.1 C51.1 C52.1 C53.1 C54.1 C55.1 C56.2 C57.2 C58.1 C59.2 C60.1 C61.2 C62.2 C63.2 C66.1 J102.3 J102.5 J102.9 J102.11 J102.13 LED2.2(K) LED3.2(K) R67.1 R68.1 U2.10(GNDA) U2.17(GND) U2.48(GND) U2.55(GND) U2.58(GND) U2.64(~{WAKE}) U2.66(XOSC0) U2.80(GND) U2.114(GND) U4.3(GND) U5.3(GND) Y1.2(GND) Y1.4(GND)
DEBUG_ID4: R58.1 U2.63(PK4)
DEBUG_ID5: R59.1 U2.62(PK5)
DEBUG_ID6: R60.1 U2.61(PK6)
DEBUG_ID7: R61.1 U2.60(PK7)
MCU_RXD: J101.2
MCU_TCK: J101.8
MCU_TDI: J101.12
MCU_TDO: J101.10
MCU_TMS: J101.6
MCU_TXD: J101.4
XDS_DM: U2.93(PL7)
XDS_DP: U2.94(PL6)
XDS_RESET_OUT: J102.10 R57.1 U2.40(PA6) U5.1(IO1)
XDS_RXD: J101.3 J102.14 U2.33(PA0) U5.5(IO4)
XDS_TCK_SWDCLK: J101.7 J102.4 U2.35(PA2) U4.1(IO1)
XDS_TDI: J101.11 J102.8 U2.38(PA5) U4.5(IO4)
XDS_TDO_SWO: J101.9 J102.6 U2.37(PA4) U4.4(IO3)
XDS_TMS_SWDIO: J101.5 J102.2 U2.36(PA3) U4.2(IO2)
XDS_TXD: J101.1 J102.12 U2.34(PA1) U5.4(IO3)
NetC50_2: C50.2 R62.2 U2.96(PB1)
NetC59_1: C59.1 C60.2 C61.1 U2.87(VDDC) U2.115(VDDC)
NetC62_1: C62.1 U2.89(OSC1) Y1.3
NetC63_1: C63.1 U2.88(OSC0) Y1.1
NetC66_2: C66.2 R70.1 U2.68(VBAT)
NetLED2_1: LED2.1(A) R63.1
NetLED3_1: LED3.1(A) R64.1
NetR63_2: R63.2 U2.3(PD2)
NetR64_2: R64.2 U2.4(PD3)
NetR65_1: R65.1 R67.2 U2.70(~{RST})
NetR68_2: R68.2 U2.59(RBIAS)

Not connected (* = marked no-connect by the designer): J102 7*; U2 1(PD0)* 2(PD1)* 5(PQ0)* 6(PQ1)* 11(PQ2)* 12(PE3)* 13(PE2)* 14(PE1)* 15(PE0)* 18(PK0)* 19(PK1)* 20(PK2)* 21(PK3)* 22(PC7)* 23(PC6)* 24(PC5)* 25(PC4)* 27(PQ3)* 29(PH0)* 30(PH1)* 31(PH2)* 32(PH3)* 41(PA7)* 42(PF0)* 43(PF1)* 44(PF2)* 45(PF3)* 46(PF4)* 49(PG0)* 50(PG1)* 53(EN0RXIN)* 54(EN0RXIP)* 56(EN0TXON)* 57(EN0TXOP)* 65(~{HIB})* 67(XOSC1)* 71(PM7)* 72(PM6)* 73(PM5)* 74(PM4)* 75(PM3)* 76(PM2)* 77(PM1)* 78(PM0)* 81(PL0)* 82(PL1)* 83(PL2)* 84(PL3)* 85(PL4)* 86(PL5)* 91(PB2)* 92(PB3)* 95(PB0)* 97(PC3/TDO/SWO)* 98(PC2/TDI)* 99(PC1/TMS/SWDIO)* 100(PC0/TCK/SWCLK)* 102(PQ4)* 103(PP2)* 104(PP3)* 105(PP4)* 106(PP5)* 107(PN0)* 108(PN1)* 109(PN2)* 110(PN3)* 111(PN4)* 112(PN5)* 116(PJ0)* 117(PJ1)* 118(PP0)* 119(PP1)* 120(PB5)* 121(PB4)* 123(PE4)* 124(PE5)* 125(PD4)* 126(PD5)* 127(PD6)* 128(PD7)*; U5 2(IO2)*

### Notes on the sheet
- (near J101) XDS110 Side
- (near J101) Target MCU Side
- To debug the F280039C, ensure that the jumpers on J101 are connected to pass the TMS and TCK signals to the MCU. RXD and TXD are optional. These are for Channel B of the Debugger to enable a serial interface to the connected PC.
  If debugging an external target, remove the jumpers from J101 and connect the external target to J102.
- Drawn By:
- SVN Rev:
- Number:
- TID #:
- Orderable:
- Rev:
- Sheet Title:
- File:
- Project Title:
- Designed for:
- Assembly Variant:
- Mod. Date:
- Sheet:
- Size:
- of
- B
- http://www.ti.com
- Texas Instruments and/or its licensors do not warrant the accuracy or completeness of this specification or any information contained therein. Texas Instruments and/or its licensors do not warrant that this design will meet the specifications, will be suitable for your application or fit for any particular purpose, or will operate in an implementation. Texas Instruments and/or its licensors do not warrant that the design is production worthy. You should completely validate and test your design implementation to confirm the system functionality for your application.
- Engineer:
- Contact:
- © Texas Instruments
- (in symbol CMP-0004635-3) G

### Library data of the parts
C50-C53 C58 = CMP-0090363-1: as C102 on sheet MCU103A_USB_and_Power; Digikey Description: CAP CER 10000PF 25V X7R 0402; RoHS: TRUE; PackageReference: 0402; Lead Free: Yes; datasheet: https://www.we-online.com/catalog/datasheet/885012205050.pdf; Datasheet Path: datasheets/Cap-885012205050.pdf; Mouser Part Number: 710-885012205050; Operating Temperature Range: -55°C to +125°C; Supplier 1: Digikey; Part Number: 885012205050; ComponentLink1URL: https://www.we-online.com/catalog/datasheet/885012205050.pdf; Tolerance_%: 10%; Digikey Part Number: 732-7545-1-ND; Temperature Characteristic: X7R; Supplier Part Number 1: 732-7545-1-ND; helpURL: https://upverter.com/upn/revision/f9df62cb48b9b255/; PartNumber: 885012205050; Supplier 2: Mouser; ComponentLink1Description: Datasheet; Supplier Part Number 2: 710-885012205050; VDC_V: 25V
C54 C55 C60 C66 = CMP-0090362-1: as C1 on sheet MCU103A_USB_and_Power; RoHS: TRUE; Tolerance_%: 10%; datasheet: https://www.we-online.com/catalog/datasheet/885012205018.pdf; Lead Free: Yes; Operating Temperature Range: -55°C to +125°C; ComponentLink1Description: Datasheet; Digikey Description: CAP CER 0.1UF 10V X7R 0402; Supplier Part Number 1: 732-7513-1-ND; Supplier 2: Mouser; Mouser Part Number: 710-885012205018; Digikey Part Number: 732-7513-1-ND; Temperature Characteristic: X7R; Supplier 1: Digikey; Datasheet Path: datasheets/Cap-885012205018.pdf; ComponentLink1URL: https://www.we-online.com/catalog/datasheet/885012205018.pdf; VDC_V: 10V; Supplier Part Number 2: 710-885012205018; Cap_F: 100nF; PackageReference: 0402; PartNumber: 885012205018; Part Number: 885012205018; helpURL: https://upverter.com/upn/revision/1acbe355db19639d/
C56 C57 C59 C61 = CMP-0064924-2: as C100 on sheet MCU103A_USB_and_Power; CompType: Capacitor; PartNumber: 885012105012; PackageReference: 0402; RoHS: Y; Tolerance_%: 20%; Value2: 10V; MountType: SMT; Technology: Ceramic; TempCo: X5R; Cap_Case: 0402; SizeY_mm: 0.5; Published: 2008-06-19; Publisher: Texas Instruments; LatestRevisionDate: 2017-06-05; ComponentLink1Description: Datasheet link; ComponentLink1URL: http://katalog.we-online.de/pbs/datasheet/885012105012.pdf; Supplier 1: Digi-Key; Supplier Part Number 1: 732-7489-1-ND; Supplier 2: Newark; Supplier Part Number 2: 75Y5997; Supplier 3: Mouser; Supplier Part Number 3: 710-885012105012; AEC Qualified: N; AEC Grade: N/A
C62 C63 = CMP-0006415-2: CAP, CERM, 12 pF, 50 V, +/- 5%, C0G/NP0, 0402; Manufacturer: MuRata; TaMin_C: -55°C; Polarized: N; SizeAreaWB_mm2: 3; Value1: Unknown; U/M: EA; Value: 12pF; TaMax_C: 125°C; SizeZ_mm: 0.6; SizeX_mm: 1; SizeY_mm: 0.5; Value2: 50V; AEC Category: Q200; Supplier Part Number 2: 81-GRM1555C1H120JA1D; Publisher: Texas Instruments; Supplier 2: Mouser; Supplier Part Number 3: 1828875; TempCo: C0G/NP0; Supplier 3: Farnell; Published: 2008-06-19; RoHS: Y; MountType: SMT; Supplier 1: Newark; PackageReference: 0402; Tolerance_%: 5%; Cap_Case: 0402; SizeArea_mm2: 0.5; CompType: Capacitor; LatestRevisionDate: 2017-03-09; PartNumber: GRM1555C1H120JA01D; AEC Qualified: ?; Cap_F: 12pF; VDC_V: 50V; ComponentLink1Description: Datasheet link; Supplier Part Number 1: 14T3292; Technology: Ceramic; ComponentLink1URL: http://search.murata.co.jp/Ceramy/PnsearchViewAction.do?HnOFG=ON&HnNFG=ON&SEL_CNT=50&sLang=en&sKey=GRM1555C1H120JA01D&x=9&y=9&search=startwith
J101 = CMP-0092423-1: THT Vertical Pin Header WR-PHD, Pitch 2.54 mm, Dual Row, 12 pins; Manufacturer: Wurth Electronics; Is Female: no; DUT-Pitch_mm: 2.54mm; Row_Count: 2; Current_A: 3A; Voltage_V: 250V; Conn Gender: Male; Conn Orientation: Straight; SizeZ_mm: 8.89mm; ContactFinish: Gold; Supplier Part Number 2: 710-61301221121; Supplier 1: Digikey; Digikey Description: CONN HEADER VERT 12POS 2.54MM; AEC Qualified: No; Part Number: 61301221121; ComponentLink1Description: Datasheet; ComponentLink1URL: https://www.we-online.com/catalog/datasheet/61301221121.pdf; Supplier Part Number 1: 732-5297-ND; Datasheet Path: datasheets/Conn-61301221121.pdf; Mouser Part Number: 710-61301221121; Supplier 2: Mouser; datasheet: https://www.we-online.com/catalog/datasheet/61301221121.pdf; PinCount: 12; PartNumber: 61301221121; Operating Temperature Range: -40°C to +105°C; helpURL: https://upverter.com/upn/revision/392edd98517a0c19/; RoHS: TRUE; Lead Free: Yes; Digikey Part Number: 732-5297-ND; PackageReference: HDR12
J102 = CMP-0092335-1: Connector, Header, Dual Row, 14 pin, .05" pitch/row spacing, Male, Shrouded, Keyed, IDC, SMT; Manufacturer: Samtec; Category 0836C53C3D42D3F1: Connectors; Category 75Fab8F04590Ae3D: Connectors and Adapters; ContactFinish: Gold,Nickel; Standoff Height: 0.15mm; Conn Orientation: Vertical; AEC Qualified: No; Category E7012A0Bd22E3Cc6: Headers & Receptacles; SizeZ_mm: 6.38mm; Category A3C16Ecb93907806: Uncategorized; DUT-Pitch_mm: 1.27mm; Current_A: 3.4A; Row_Count: 2; PartNumber: FTSH-107-01-F-DV-K; Operating Temperature Range: -55°C to +125°C; Supplier Part Number 2: 200-FTSH10701FDVK; datasheet: https://suddendocs.samtec.com/catalog_english/ftsh_smt.pdf; Supplier Part Number 1: 612-FTSH-107-01-F-DV-K-ND; Supplier 2: Mouser; Supplier 1: Digikey; Datasheet Path: datasheets/Conn-FTSH-107-01-F-DV-K.pdf; ComponentLink1Description: Datasheet; Conn Gender: Male; Digikey Description: CONN HEADER SMD 14POS 1.27MM; Part Number: FTSH-107-01-F-DV-K; Mouser Part Number: 200-FTSH10701FDVK; helpURL: https://upverter.com/upn/revision/57d08244f4d86490/; RoHS: TRUE; Lead Free: Yes; Octopart Part Number: b9dd70752dfc661a; Category Bda670Ac885E6661: Uncategorized; PinCount: 14; Is Female: no; ComponentLink1URL: https://suddendocs.samtec.com/catalog_english/ftsh_smt.pdf; PackageReference: HDR14; Mouser Description: Conn Unshrouded Header HDR 14 POS 1.27mm Solder ST SMD Tube; Digikey Part Number: 612-FTSH-107-01-F-DV-K-ND
LED2 LED3 = CMP-0002889-2: LED, Blue, SMD; Manufacturer: Lite-On; Type: AlInGaP; Vf_V: 3.3V; Io_A: 20mA; Value1: W; PartNumber: LTST-C170TBKT; PackageReference: LED_0805; RoHS: Y; CompType: LED; MountType: SMT; Value2: 3.3V; Color: Blue; ComponentLink1URL: http://optoelectronics.liteon.com/upload/download/DS-22-99-0226/S_110_LTST-C170TBKT.pdf; ComponentLink1Description: Datasheet link
R57 = CMP-0026918-5: RES, 3.3 k, 5%, 0.063 W, AEC-Q200 Grade 0, 0402; Manufacturer: Vishay-Dale; Value: 3.3k; Value_Code: 3k30; Power_W: 63mW; Value2: 0.063W; VDC_V: 50V; TempCo: 200 ppm/C; SizeArea_mm2: 0.5; SizeX_mm: 1; SizeZ_mm: 0.6; EIA_Code: E24; AEC Category: Q200; AEC Qualified: Y; AEC Grade: 0; CompType: Resistor; PartNumber: CRCW04023K30JNED; PackageReference: 0402; RoHS: E; Res_ohm: 3.3k; Tolerance_%: 5%; Value1: 5%; MountType: SMT; Technology: Thick Film; SizeY_mm: 0.5; ComponentLink1Description: Datasheet link; ComponentLink1URL: http://www.vishay.com/docs/20035/dcrcwe3.pdf; Supplier 1: Digi-Key; Supplier Part Number 1: 541-3.3KJCT-ND; Supplier 2: Newark; Supplier Part Number 2: 59M6723; Supplier 3: Mouser; Supplier Part Number 3: 71-CRCW0402J-3.3K-E3
R58-R61 = CMP-0026071-3: RES, 1.00 k, 1%, 0.063 W, AEC-Q200 Grade 0, 0402; Manufacturer: Vishay-Dale; Power_W: 63mW; TempCo: 100 ppm/C; Value_Code: 1k00; Value: 1.00k; EIA_Code: E96; Res_ohm: 1k; SizeX_mm: 1; SizeY_mm: 0.5; SizeZ_mm: 0.6; Value2: 0.063W; AEC Qualified: Y; VDC_V: 50V; AEC Category: Q200; AEC Grade: 0; Supplier Part Number 2: 52K6545; Supplier 2: Newark; Supplier Part Number 3: 71-CRCW0402-1.0K-E3; Supplier 3: Mouser; RoHS: E; Value1: 1%; MountType: SMT; Supplier 1: Digi-Key; PackageReference: 0402; Tolerance_%: 1%; SizeArea_mm2: 0.5; CompType: Resistor; PartNumber: CRCW04021K00FKED; ComponentLink1Description: Datasheet link; Supplier Part Number 1: 541-1.00KLCT-ND; Technology: Thick Film; ComponentLink1URL: http://www.vishay.com/docs/20035/dcrcwe3.pdf
R62 = CMP-0026824-3: RES, 100, 5%, 0.063 W, AEC-Q200 Grade 0, 0402; Manufacturer: Vishay-Dale; Value: 100; Value_Code: 100R; Power_W: 63mW; Value2: 0.063W; VDC_V: 50V; TempCo: 200 ppm/C; SizeArea_mm2: 0.5; SizeX_mm: 1; SizeZ_mm: 0.6; EIA_Code: E24; AEC Category: Q200; AEC Qualified: Y; AEC Grade: 0; CompType: Resistor; PartNumber: CRCW0402100RJNED; PackageReference: 0402; RoHS: E; Res_ohm: 100; Tolerance_%: 5%; Value1: 5%; MountType: SMT; Technology: Thick Film; SizeY_mm: 0.5; ComponentLink1Description: Datasheet link; ComponentLink1URL: http://www.vishay.com/docs/20035/dcrcwe3.pdf; Supplier 1: Digi-Key; Supplier Part Number 1: 541-100JCT-ND; Supplier 2: Newark; Supplier Part Number 2: 59M6700; Supplier 3: Mouser; Supplier Part Number 3: 71-CRCW0402J-100-E3
R63 R64 = CMP-0026736-1: RES, 470, 1%, 0.063 W, 0402; Manufacturer: Yageo America; Power_W: 63mW; TempCo: 100 ppm/C; Value_Code: 470R; U/M: EA; Value: 470; SizeX_mm: 1; SizeY_mm: 0.5; SizeZ_mm: 0.6; Value2: 0.063W; AEC Qualified: N; VDC_V: 50V; AEC Category: Q200; ComponentLink1URL: http://www.yageo.com/documents/recent/PYu-RC_Group_51_RoHS_L_04.pdf; Supplier Part Number 2: 67R9940; Publisher: Texas Instruments; Supplier 2: Newark; Supplier Part Number 3: 603-RC0402FR-07470RL; Supplier 3: Mouser; Published: 2008-06-26; RoHS: Y; Value1: 1%; MountType: SMT; Supplier 1: Digi-Key; PackageReference: 0402; Tolerance_%: 1%; Res_ohm: 470; SizeArea_mm2: 0.5; CompType: Resistor; LatestRevisionDate: 2017-03-09; PartNumber: RC0402FR-07470RL; ComponentLink1Description: Datasheet link; AEC Grade: N/A; Supplier Part Number 1: 311-470LRCT-ND; Technology: Thick Film
R65 R67 = CMP-0026825-5: RES, 10 k, 5%, 0.063 W, AEC-Q200 Grade 0, 0402; Manufacturer: Vishay-Dale; Value: 10k; Value_Code: 10k0; Power_W: 63mW; Value2: 0.063W; VDC_V: 50V; TempCo: 200 ppm/C; SizeArea_mm2: 0.5; SizeX_mm: 1; SizeZ_mm: 0.6; EIA_Code: E24; AEC Category: Q200; AEC Qualified: Y; AEC Grade: 0; CompType: Resistor; PartNumber: CRCW040210K0JNED; PackageReference: 0402; RoHS: E; Res_ohm: 10k; Tolerance_%: 5%; Value1: 5%; MountType: SMT; Technology: Thick Film; SizeY_mm: 0.5; ComponentLink1Description: Datasheet link; ComponentLink1URL: http://www.vishay.com/docs/20035/dcrcwe3.pdf; Supplier 1: Digi-Key; Supplier Part Number 1: 541-10KJCT-ND; Supplier 2: Newark; Supplier Part Number 2: 59M6696; Supplier 3: Mouser; Supplier Part Number 3: 71-CRCW0402J-10K-E3
R68 = CMP-0026413-2: RES, 4.87 k, 1%, 0.063 W, AEC-Q200 Grade 0, 0402; Manufacturer: Vishay-Dale; Value: 4.87k; Value_Code: 4k87; Power_W: 63mW; Value2: 0.063W; VDC_V: 50V; TempCo: 100 ppm/C; SizeArea_mm2: 0.5; SizeX_mm: 1; SizeZ_mm: 0.6; EIA_Code: E96; AEC Category: Q200; AEC Qualified: Y; AEC Grade: 0; CompType: Resistor; PartNumber: CRCW04024K87FKED; PackageReference: 0402; RoHS: E; Res_ohm: 4.87k; Tolerance_%: 1%; Value1: 1%; MountType: SMT; Technology: Thick Film; SizeY_mm: 0.5; ComponentLink1Description: Datasheet link; ComponentLink1URL: http://www.vishay.com/docs/20035/dcrcwe3.pdf; Supplier 1: Digi-Key; Supplier Part Number 1: 541-4.87KLCT-ND; Supplier 2: Newark; Supplier Part Number 2: 52K7047; Supplier 3: Mouser; Supplier Part Number 3: 71-CRCW0402-4.87K-E3
R70 = CMP-0026946-3: RES, 51, 5%, 0.063 W, AEC-Q200 Grade 0, 0402; Manufacturer: Vishay-Dale; Value: 51; Value_Code: 51R0; Power_W: 63mW; Value2: 0.063W; VDC_V: 50V; TempCo: 200 ppm/C; SizeArea_mm2: 0.5; SizeX_mm: 1; SizeZ_mm: 0.6; EIA_Code: E24; AEC Category: Q200; AEC Qualified: Y; AEC Grade: 0; CompType: Resistor; PartNumber: CRCW040251R0JNED; PackageReference: 0402; RoHS: E; Res_ohm: 51; Tolerance_%: 5%; Value1: 5%; MountType: SMT; Technology: Thick Film; SizeY_mm: 0.5; ComponentLink1Description: Datasheet link; ComponentLink1URL: http://www.vishay.com/docs/20035/dcrcwe3.pdf; Supplier 1: Digi-Key; Supplier Part Number 1: 541-51JCT-ND; Supplier 2: Newark; Supplier Part Number 2: 72M6804; Supplier 3: Mouser; Supplier Part Number 3: 71-CRCW0402J-51-E3
U2 = CMP-0077953-1: MSP432E401YTPDT, PDT0128A (TQFP-128); Alternate PartNumber: MSP432E401YTPDTR; Alternate Manufacturer: Texas Instruments; SizeAreaWB_mm2: 324; SizeZ_mm: 1.2; SizeX_mm: 16; SizeArea_mm2: 256; CompType: IC; AEC Qualified: N; AEC Category: Q200; ComponentLink1URL: http://www.ti.com/lit/ds/symlink/tm4c129encpdt.pdf; PackageDescription: TQFP-128; MountType: SMT; ComponentLink2URL: TBD; ComponentLink2Description: Product Folder; Manufacturer: Texas Instruments; PackageReference: PDT0128A; SizeY_mm: 16; PartNumber: MSP432E401YTPDT; ComponentLink1Description: Datasheet Link
U4 U5 = CMP-0043115-3: 4-Channel ESD Protection Array for High-Speed Data Interfaces, DRY0006A (USON-6); Manufacturer: Texas Instruments; IO Leakage Current(nA): 1; USB High Speed: TRUE; IO Capacitance(Typ)(pF): 1.6; Eco-Plan: Green (RoHS & no Sb/Br); IEC 61000-4-2 Contact(+/- kV): 8; Breakdown Voltage(Min)(V): 6; IEC 61000-4-2 Air-Gap(+/- kV): 12; AEC Category: Q200; AEC Qualified: N; CompType: IC; SizeAreaWB_mm2: 4.9; SizeArea_mm2: 1.45; SizeX_mm: 1.0; SizeZ_mm: 0.6; Rating: Catalog; ComponentLink3URL: http://www.ti.com/product/tpd4e004/datasheet; ComponentLink1Description: Datasheet Link; ComponentLink2URL: http://www.ti.com/product/tpd4e004; ComponentLink1URL: http://www.ti.com/lit/ds/symlink/tpd4e004.pdf; PackageDescription: USON-6; 1394 / Firewire: TRUE; PackageReference: DRY0006A; ComponentLink3Description: Online Datasheet; ComponentLink2Description: Product Folder; Serial ATA / eSATA: TRUE; PartNumber: TPD4E004DRYR; MountType: SMT; RoHS: Y; SizeY_mm: 1.45; Operating Temperature Range: -40 to 85 C
Y1 = CMP-0004635-3: Crystal, 16 MHz, 8pF, SMD; Manufacturer: NDK; TaMin_C: -10°C; TaMax_C: 70°C; Frequency Stability: +/-30ppm; Frequency_Fixed: 16MHz; PartNumber: NX3225GA-16.000M-STD-CRG-1; CompType: Crystal; PackageReference: 3.2x0.75x2.5mm; MountType: SMT; RoHS: Y; ComponentLink1Description: Datasheet Link; ComponentLink1URL: http://www.ndk.com/images/products/catalog/c_NX3225GA-STD-CRG-1_e.pdf; Supplier 1: Digi-Key; Supplier Part Number 1: 644-1157-1-ND